# EAGLE design li-ion_v2 (EAGLE 7.2.0)
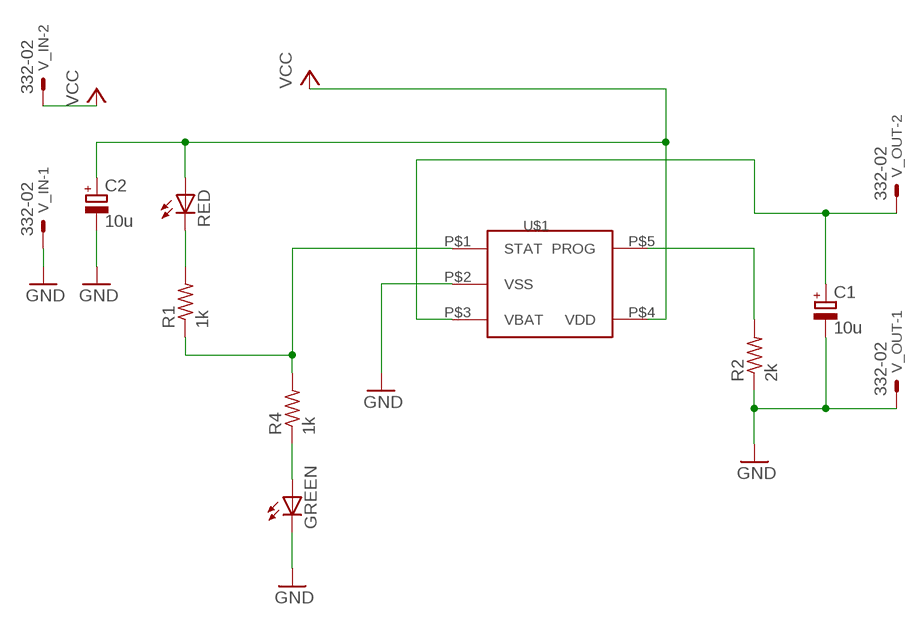
[diagram p0: schematic, sheet 1]

## Parts
C1  10u  CPOL-EUE1.8-4  [E1,8-4]
C2  10u  CPOL-EUE1.8-4  [E1,8-4]
GREEN  LED3MM  [LED3MM]
R1  1k  R-US_0204/5  [0204/5]
R2  2k  R-US_0204/5  [0204/5]
R4  1k  R-US_0204/5  [0204/5]
RED  LED3MM  [LED3MM]
U$1  MCP73831  [5PIN_SOT23]
V_IN  332-02  [332-02]
V_OUT  332-02  [332-02]

## Nets
GND: C1.- C2.- GREEN.K(C) R2.1 U$1.P$2(VSS) V_IN.1 V_OUT.1
N$1: C1.+ U$1.P$3(VBAT) V_OUT.2
N$2: R2.2 U$1.P$5(PROG)
N$3: R1.1 R4.2 U$1.P$1(STAT)
N$4: R1.2 RED.K(C)
N$6: GREEN.A R4.1
VCC: C2.+ RED.A U$1.P$4(VDD) V_IN.2

## Library data of the parts
C1 C2 = rcl:CPOL-EU: POLARIZED CAPACITOR, European symbol
GREEN RED = led:LED: LED OSRAM: - CHIPLED LG R971, LG N971, LY N971, LG Q971, LY Q971, LO R971, LY R971 LH N974, LH R974 LS Q976, LO Q976, LY Q976 LO Q996 - Hyper CHIPLED LW Q18S LB Q993, LB Q99A, LB R99A - SideLED LS A670, LO A670, LY A670, LG A670, LP A670 LB A673, LV A673, LT A673, LW A673 LH A674 LY A675 LS A676, LA A676, LO A676, LY A676, LW A676 LS A679, LY A679, LG A679 - Hyper Micro SIDELED® LS Y876, LA Y876, LO Y876, LY Y876 LT Y87S - SmartLED LW L88C, LW L88S LB L89C, LB L89S, LG L890 LS L89K, LO L89K, LY L89K LS L896, LA L896, LO L896, LY L896 - TOPLED LS T670, LO T670, LY T670, LG T670, LP T670 LSG T670, LSP T670, LSY T670, LOP T670, LYG T670 LG T671, LOG T671, LSG T671 LB T673, LV T673, LT T673, LW T673 LH T674 LS T676, LA T676, LO T676, LY T676, LB T676, LH T676, LSB T676, LW T676 LB T67C, LV T67C, LT T67C, LS T67K, LO T67K, LY T67K, LW E67C LS E67B, LA E67B, LO E67B, LY E67B, LB E67C, LV E67C, LT E67C LW T67C LS T679, LY T679, LG T679 LS T770, LO T770, LY T770, LG T770, LP T770 LB T773, LV T773, LT T773, LW T773 LH T774 LS E675, LA E675, LY E675, LS T675 LS T776, LA T776, LO T776, LY T776, LB T776 LHGB T686 LT T68C, LB T68C - Hyper Mini TOPLED® LB M676 - Mini TOPLED Santana® LG M470 LS M47K, LO M47K, LY M47K Source: http://www.osram.convergy.de LUXEON: - LUMILED® LXK2-PW12-R00, LXK2-PW12-S00, LXK2-PW14-U00, LXK2-PW14-V00 LXK2-PM12-R00, LXK2-PM12-S00, LXK2-PM14-U00 LXK2-PE12-Q00, LXK2-PE12-R00, LXK2-PE12-S00, LXK2-PE14-T00, LXK2-PE14-U00 LXK2-PB12-K00, LXK2-PB12-L00, LXK2-PB12-M00, LXK2-PB14-N00, LXK2-PB14-P00, LXK2-PB14-Q00 LXK2-PR12-L00, LXK2-PR12-M00, LXK2-PR14-Q00, LXK2-PR14-R00 LXK2-PD12-Q00, LXK2-PD12-R00, LXK2-PD12-S00 LXK2-PH12-R00, LXK2-PH12-S00 LXK2-PL12-P00, LXK2-PL12-Q00, LXK2-PL12-R00 Source: www.luxeon.com KINGBRIGHT: KA-3528ASYC Source: www.kingbright.com
R1 R2 R4 = rcl:R-US_: RESISTOR, American symbol
U$1 = mcp73831:MCP73831: Digikey No:- __MCP73831T-2ACI/OTCT-ND__
V_IN V_OUT = con-garry:332-02: 2 Pin - 2mm Dual Row Source: www.mpe-connector.de / garry_shortform_2012.pdf

## Board
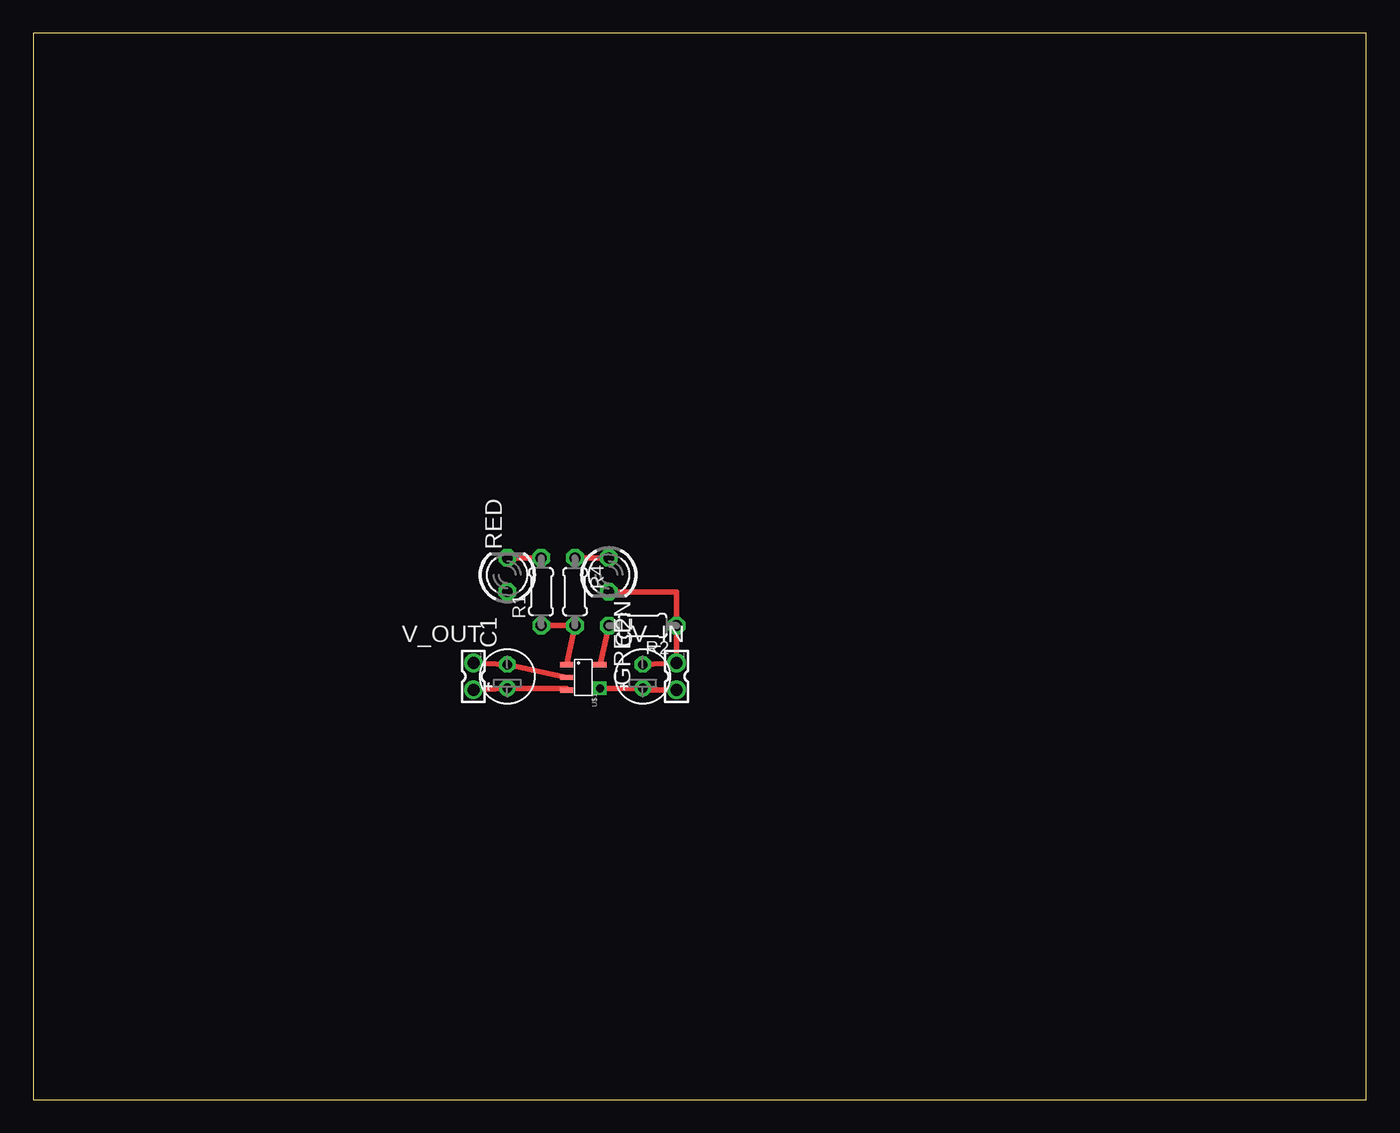
[diagram p1: board, top side]
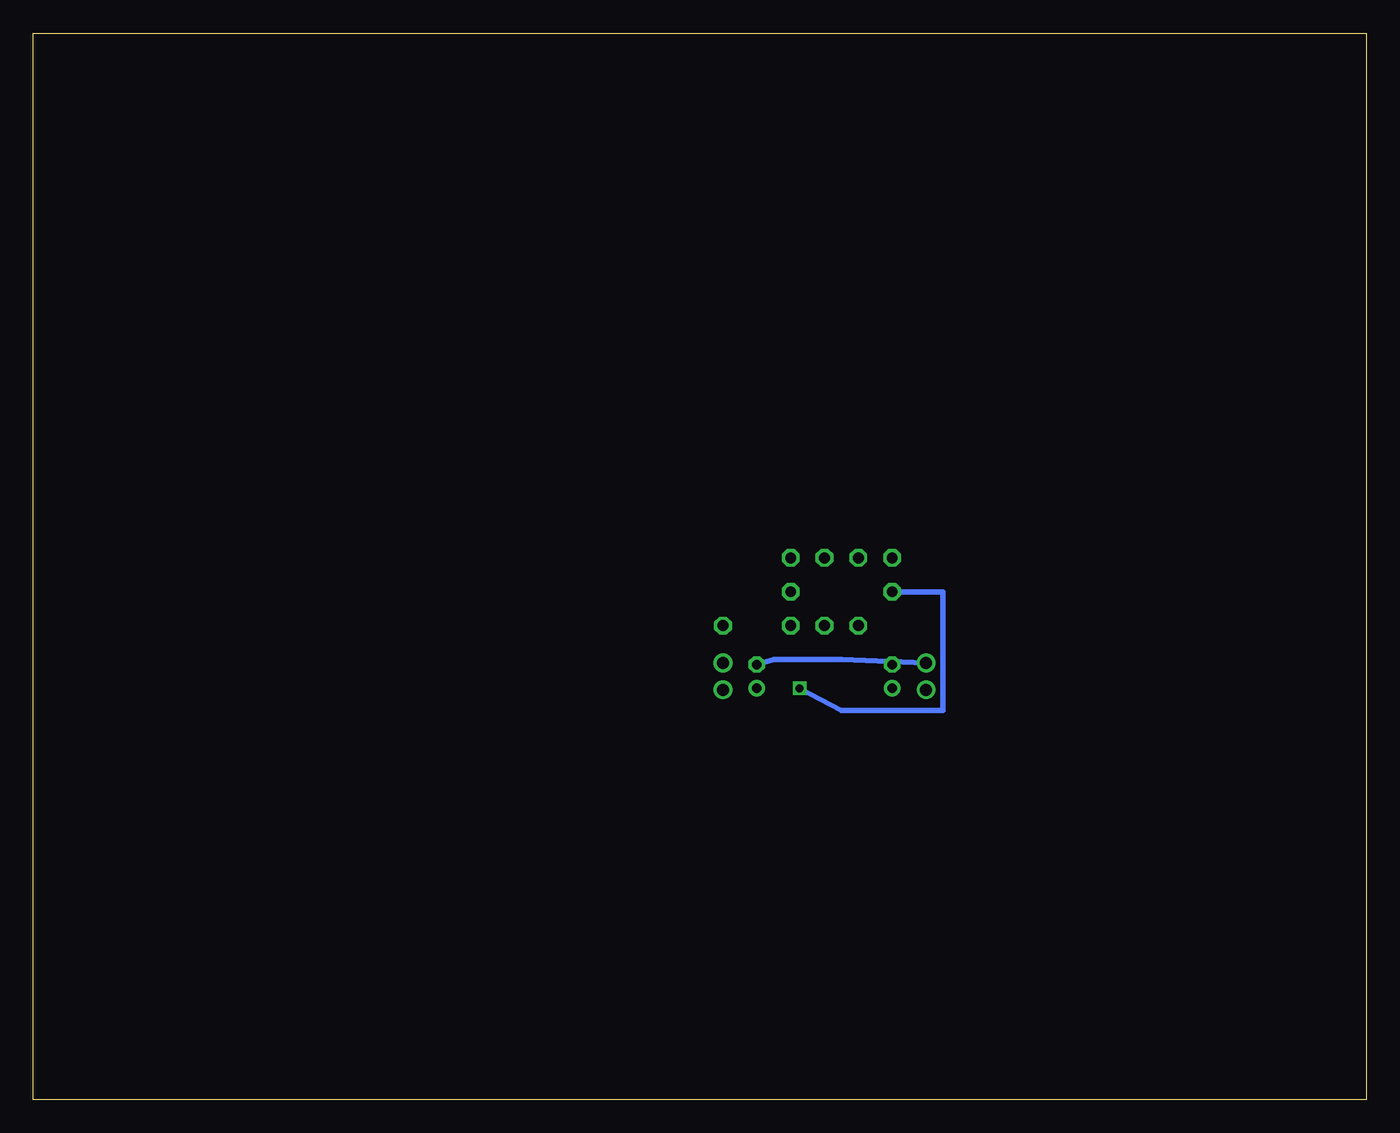
[diagram p2: board, bottom side, seen from below]

Size 100 x 80 mm. Coordinates in mm from the lower left corner, seen from the top.
Outline: 0,0 100,0 100,80 0,80 0,0
Copper layers (1*16): Top 0.035mm / dielectric 1.5mm / Bottom 0.035mm
Design rules "default": minimum track width 10mil, minimum drill 24mil, track to track 8mil, track to pad 8mil, pad to pad 8mil, via to via 8mil, smd to smd 8mil, copper to edge 40mil, drill to drill 8mil, minimum pad ring 10mil, minimum via ring 8mil, stop-mask expansion 4mil, vias tented up to drill 0mil, thermal gap 10mil

### Footprints (pad centres in the part's own frame; a part is rotated, then mirrored left to right if it is on the bottom)
E1,8-4 = drill 0.711 pad 1.168: + -0.889,0 | drill 0.711 pad 1.168 octagon: - 0.889,0
LED3MM = drill 0.813 octagon: A -1.27,0; K 1.27,0
0204/5 = drill 0.813 octagon: 1 -2.54,0; 2 2.54,0
5PIN_SOT23 = smd 0.4 x 1: P$1 0.4,-0.63; P$2 1.35,-0.63; P$3 2.3,-0.63; P$4 2.3,1.87; P$5 0.4,1.87
332-02 = drill 0.9 pad 1.27: 1 0,-1; 2 0,1

### Placement (x,y rotation side)
C1  35.56,31.75 90 top
C2  45.72,31.75 90 top
GREEN  43.18,39.37 270 top
R1  38.1,38.1 90 top
R2  45.72,35.56 180 top
R4  40.64,38.1 270 top
RED  35.56,39.37 90 top
U$1  40.64,33.02 270 top
V_IN  48.26,31.75 180 top
V_OUT  33.02,31.75 180 top

### Tracks (layer width: path | path; a pad name or v marks a point on that pad's centre or on a via)
GND
  Top 0.406: 45.72,32.75 C2.- V_IN.1 R2.1 48.26,38.1 GREEN.K | U$1.P$2 C1.- V_OUT.1
  Bottom 0.406: V_OUT.1 39.37,33.02 44.45,33.02 C2.-
N$1
  Top 0.406: U$1.P$3 40.01,30.86 C1.+ V_OUT.2
N$2
  Top 0.406: R2.2 U$1.P$5
N$3
  Top 0.406: U$1.P$1 R4.2 R1.1
N$4
  Top 0.406: R1.2 RED.K
N$6
  Top 0.406: GREEN.A R4.1
VCC  (via drill 0.6)
  Top 0.406: V_IN.2 45.72,30.75 C2.+ v42.51,30.86 U$1.P$4
  Bottom 0.406: v42.51,30.86 39.37,29.21 31.75,29.21 31.75,38.1 RED.A